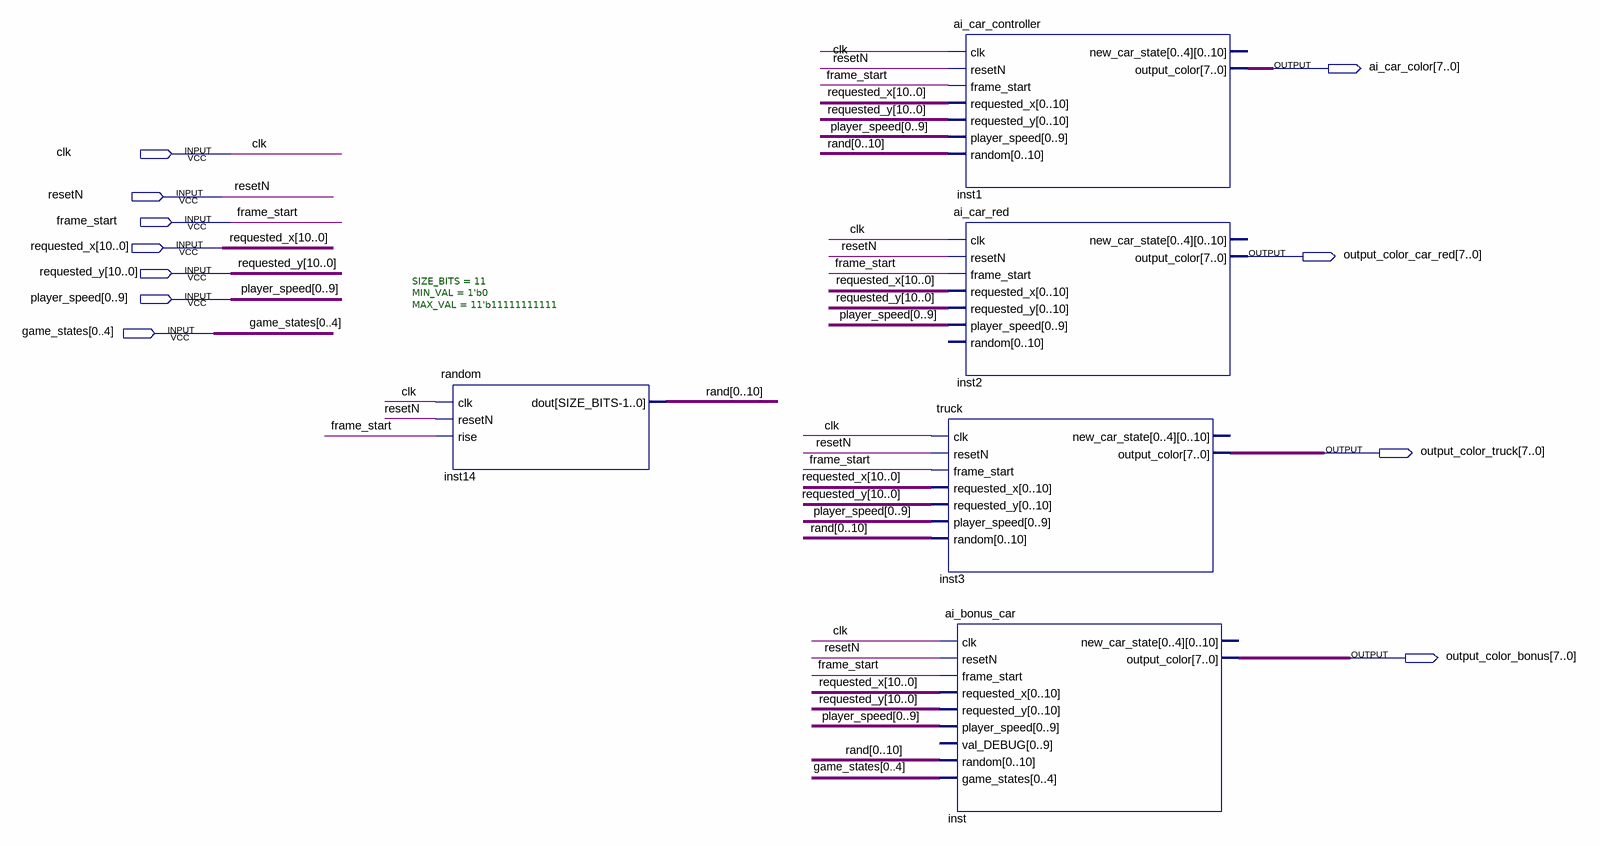
[diagram p0: schematic sheet]
// Quartus schematic ai_cars.bdf as structural Verilog: 5 symbols, 11 pins
module ai_cars (
  input  clk,
  input  resetN,
  input  frame_start,
  input  [10:0] requested_x,
  input  [10:0] requested_y,
  input  [0:9] player_speed,
  input  [0:4] game_states,
  output [7:0] ai_car_color,
  output [7:0] output_color_car_red,
  output [7:0] output_color_truck,
  output [7:0] output_color_bonus
);

  wire [10:0] \rand ;

  random #(.SIZE_BITS(11), .MIN_VAL(1'b0), .MAX_VAL(11'b11111111111)) inst14 (
    .clk(clk), .resetN(resetN), .rise(frame_start),
    .dout({\rand [0], \rand [1], \rand [2], \rand [3], \rand [4], \rand [5], \rand [6], \rand [7], \rand [8], \rand [9], \rand [10]}));
  ai_car_controller inst1 (
    .clk(clk), .resetN(resetN), .frame_start(frame_start), .requested_x(requested_x),
    .requested_y(requested_y), .player_speed(player_speed),
    .random({\rand [0], \rand [1], \rand [2], \rand [3], \rand [4], \rand [5], \rand [6], \rand [7], \rand [8], \rand [9], \rand [10]}),
    .output_color(ai_car_color));  // open: new_car_state
  ai_car_red inst2 (
    .clk(clk), .resetN(resetN), .frame_start(frame_start), .requested_x(requested_x),
    .requested_y(requested_y), .player_speed(player_speed), .output_color(output_color_car_red));  // open: random, new_car_state
  truck inst3 (
    .clk(clk), .resetN(resetN), .frame_start(frame_start), .requested_x(requested_x),
    .requested_y(requested_y), .player_speed(player_speed),
    .random({\rand [0], \rand [1], \rand [2], \rand [3], \rand [4], \rand [5], \rand [6], \rand [7], \rand [8], \rand [9], \rand [10]}),
    .output_color(output_color_truck));  // open: new_car_state
  ai_bonus_car inst (
    .clk(clk), .resetN(resetN), .frame_start(frame_start), .requested_x(requested_x),
    .requested_y(requested_y), .player_speed(player_speed),
    .random({\rand [0], \rand [1], \rand [2], \rand [3], \rand [4], \rand [5], \rand [6], \rand [7], \rand [8], \rand [9], \rand [10]}),
    .game_states(game_states), .output_color(output_color_bonus));  // open: val_DEBUG, new_car_state
endmodule
